# EAGLE design lcd (EAGLE 6.1)
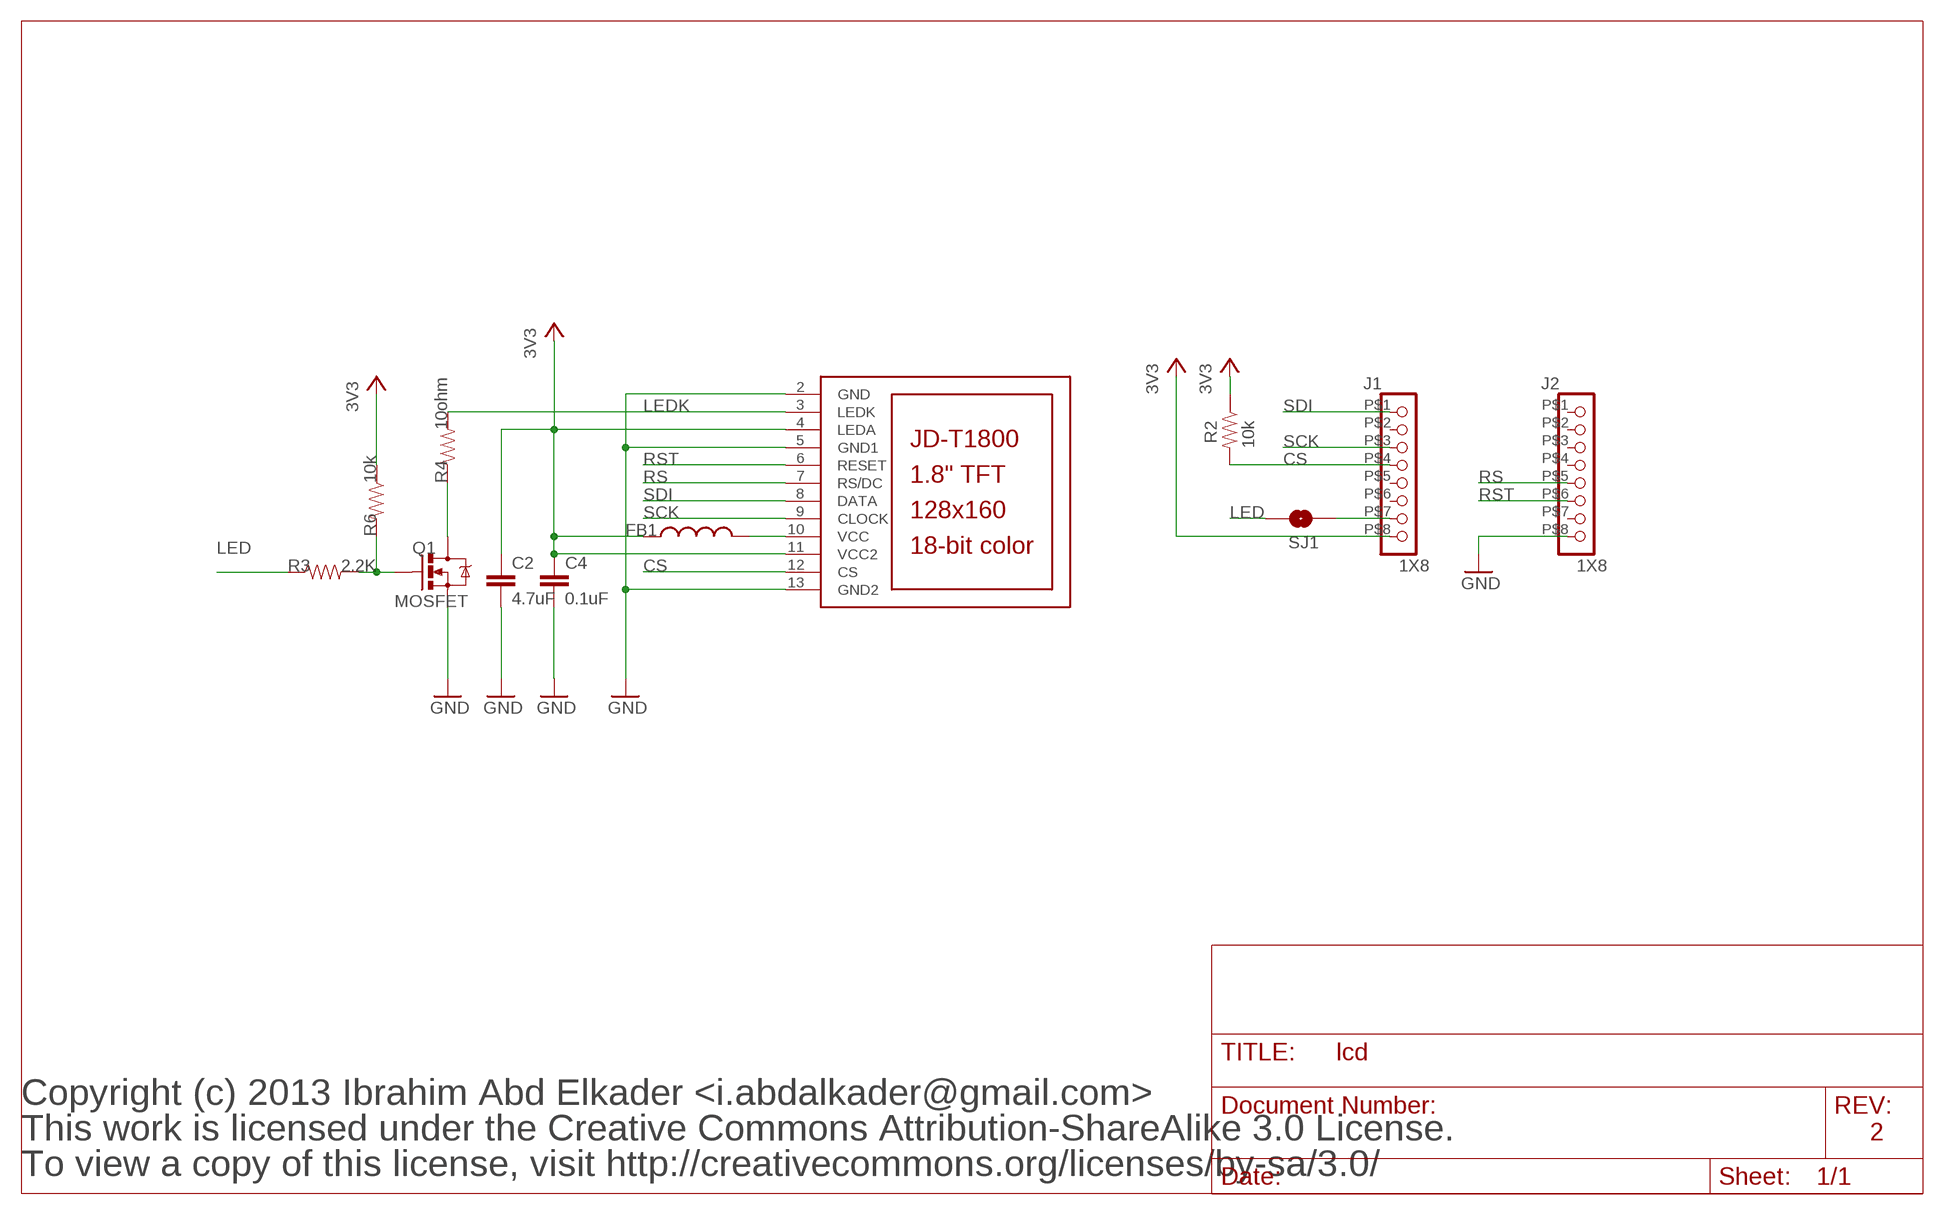
[diagram p0: schematic, sheet 1]

## Parts
C2  4.7uF  CAP0603-CAP  [0603-CAP]
C4  0.1uF  CAP0603-CAP  [0603-CAP]
FB1  INDUCTOR0603  [0603]
J1  1X8  [1X8]
J2  1X8  [1X8]
LCD1  JD-T1800  [JD-T1800]
Q1  MOSFET  MOSFET-NCHANNELSMD  [SOT23-3]
R2  10k  RESISTOR0603-RES  [0603-RES]
R3  2.2K  RESISTOR0603-RES  [0603-RES]
R4  10ohm  RESISTOR0603-RES  [0603-RES]
R6  10k  RESISTOR0603-RES  [0603-RES]
SJ1  SOLDERJUMPERTRACE  [SJ_2S-TRACE]

## Nets
3V3: C2.1 C4.1 FB1.1 J1.P$8 LCD1.4(LEDA) LCD1.11(VCC2) R2.1 R6.1
CS: J1.P$4 LCD1.12(CS) R2.2
GND: C2.2 C4.2 J2.P$8 LCD1.2(GND) LCD1.5(GND1) LCD1.13(GND2) Q1.2(S)
LED: R3.1 SJ1.2
LEDK: LCD1.3(LEDK) R4.2
N$2: J1.P$7 SJ1.1
N$5: Q1.1(G) R3.2 R6.2
N$14: Q1.3(D) R4.1
RS: J2.P$5 LCD1.7(RS/DC)
RST: J2.P$6 LCD1.6(RESET)
SCK: J1.P$3 LCD1.9(CLOCK)
SDI: J1.P$1 LCD1.8(DATA)
VDDA: FB1.2 LCD1.10(VCC)
Unconnected: J1.P$2 J1.P$5 J1.P$6 J2.P$1 J2.P$2 J2.P$3 J2.P$4 J2.P$7

## Notes on the sheet
- Copyright (c) 2013 Ibrahim Abd Elkader <i.abdalkader@gmail.com>
- This work is licensed under the Creative Commons Attribution-ShareAlike 3.0 License. | 2
- To view a copy of this license, visit http://creativecommons.org/licenses/by-sa/3.0/

## Library data of the parts
C2 C4 = sfe:CAP: Capacitor Standard 0603 ceramic capacitor, and 0.1" leaded capacitor.
FB1 = sfe:INDUCTOR: Inductors Basic Inductor/Choke - 0603 and 1206. Footprints are not proven and vary greatly between part numbers.
J1 J2 = sullins:1X8
LCD1 = adafruit:JD-T1800
Q1 = sfe:MOSFET-NCHANNEL
R2-R4 R6 = sfe:RESISTOR: Resistor Basic schematic elements and footprints for 0603, 1206, and PTH resistors.
SJ1 = sfe:SOLDERJUMPER: Solder Jumper Standard SMD solder jumper. Used to automate production. Two varients : Normally Open and Normally Closed are the same, but have different paste layers. NC will have a large amount of paste and should jumper during reflow.

## Net classes
1 vcc: width 1.016 mm, clearance 0.203 mm
2 antenna: width 0.363 mm, clearance 0.305 mm
3 1.8v: width 0.457 mm, clearance 0.254 mm

## Board
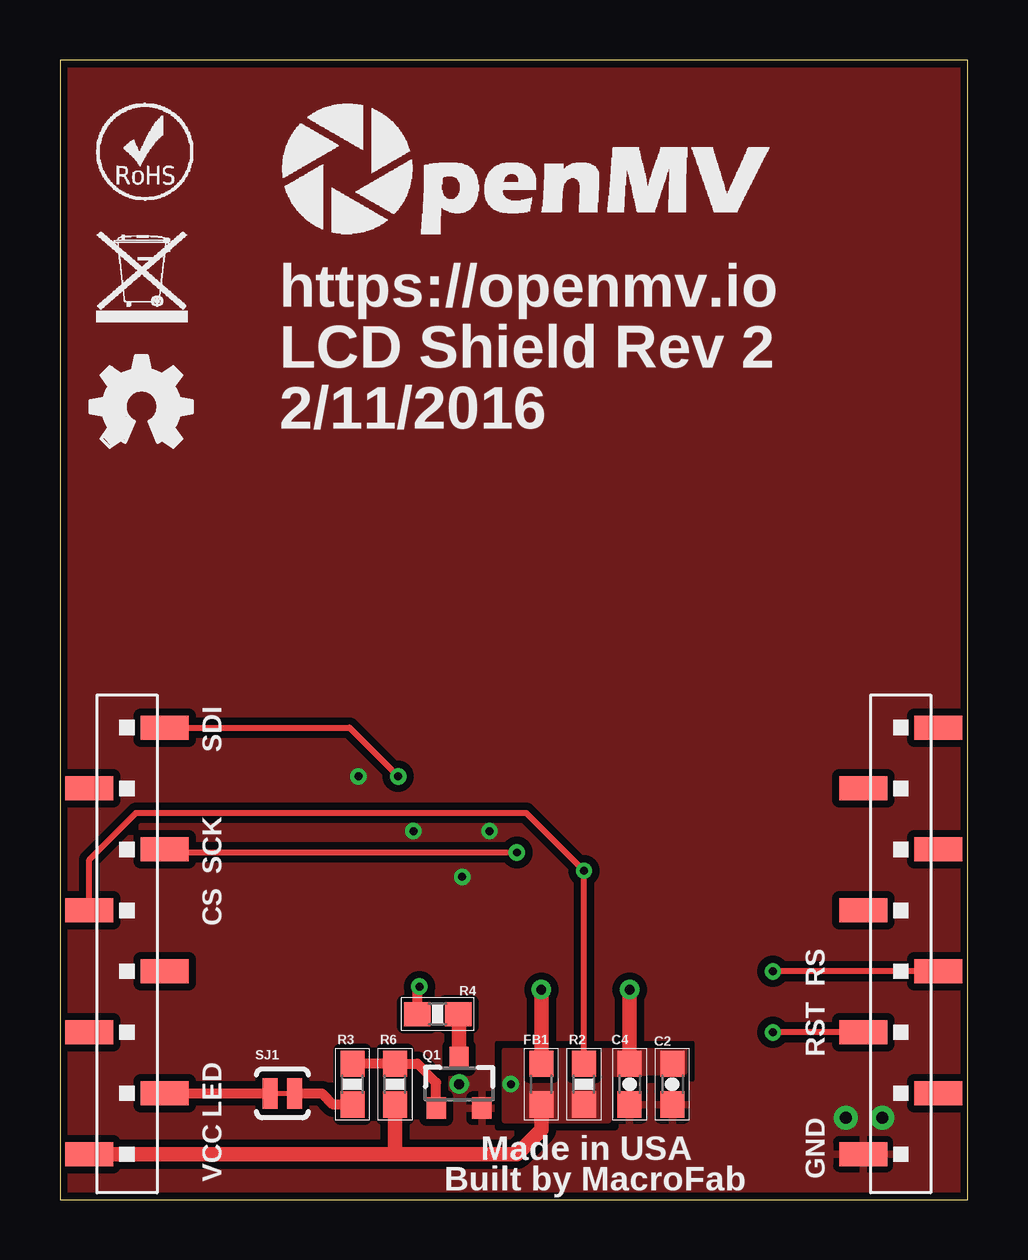
[diagram p1: board, top side]
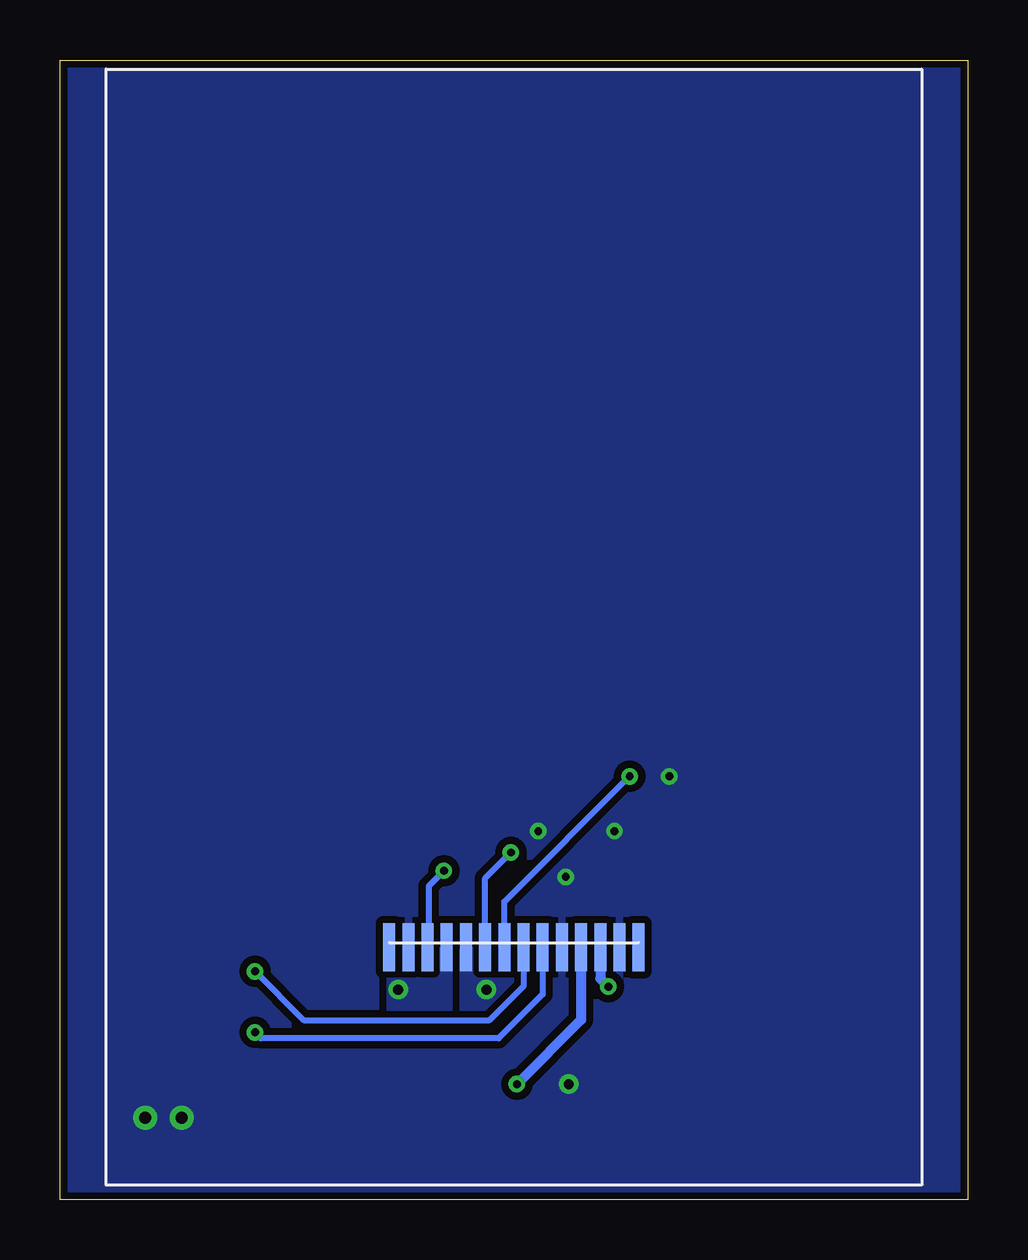
[diagram p2: board, bottom side, seen from below]

Size 37.85 x 47.5 mm. Coordinates in mm from the lower left corner, seen from the top.
Outline: 0,0 37.85,0 37.85,47.5 0,47.5 0,0
Copper layers (1*16): Top 0.0356mm / dielectric 1.5011mm / Bottom 0.0356mm
Design rules: minimum track width 6mil, minimum drill 13mil, track to track 6mil, track to pad 6mil, pad to pad 6mil, via to via 6mil, smd to smd 6mil, copper to edge 5mil, drill to drill 6mil, minimum pad ring 7mil, minimum via ring 7mil, stop-mask expansion 3mil, vias tented up to drill 30mil, thermal gap 10mil

### Footprints (pad centres in the part's own frame; a part is rotated, then mirrored left to right if it is on the bottom)
0603-CAP = smd 1.1 x 1: 1 -0.85,0; 2 0.85,0
0603 = smd 1.1 x 1: 1 -0.85,0; 2 0.85,0
1X8 = smd 1 x 2: P$1 8.89,-1.57; P$2 6.35,1.57; P$3 3.81,-1.57; P$4 1.27,1.57; P$5 -1.27,-1.57; P$6 -3.81,1.57; P$7 -6.35,-1.57; P$8 -8.89,1.57
JD-T1800 = smd 0.5 x 2: 1 5.2,-13.1; 2 4.4,-13.1; 3 3.6,-13.1; 4 2.8,-13.1; 5 2,-13.1; 6 1.2,-13.1; 7 0.4,-13.1; 8 -0.4,-13.1; 9 -1.2,-13.1; 10 -2,-13.1; 11 -2.8,-13.1; 12 -3.6,-13.1; 13 -4.4,-13.1; 14 -5.2,-13.1
SOT23-3 = smd 0.8 x 0.9: 1 -0.95,-1; 2 0.95,-1; 3 0,1.1
0603-RES = smd 1.1 x 1: 1 -0.85,0; 2 0.85,0
SJ_2S-TRACE = smd 0.635 x 1.27: 1 -0.508,0; 2 0.508,0

### Placement (x,y rotation side)
C2  25.53,4.83 270 top
C4  23.75,4.83 270 top
FB1  20.07,4.83 90 top
J1  2.79,10.79 90 top
J2  35.05,10.79 90 top
LCD1  18.92,23.62 0 bottom
Q1  16.64,4.83 0 top
R2  21.84,4.83 90 top
R3  12.19,4.83 90 top
R4  15.75,7.75 180 top
R6  13.97,4.83 90 top
SJ1  9.27,4.45 0 top
U$2  [ROHS]  1.52,41.66 0 top
U$3  [WEEE]  1.52,36.58 0 top
U$4  [OMV-LOGO-BIG]  9.27,40.26 0 top
U$5  [OSHW_FILLX150_NOTEXT]  1.27,31.37 0 top

### Tracks (layer width: path | path; a pad name or v marks a point on that pad's centre or on a via)
3V3  (via drill 0.33, 0.41)
  Top 0.61: J1.P$8 13.97,1.91 | 13.97,1.91 19.05,1.91 20.07,2.92 FB1.1 | C4.1 v23.75,8.76 | R6.1 13.97,1.91
  Bottom 0.406: LCD1.4 16.12,7.5 v18.8,4.83
  pour Top (isolate 0.254, no thermals): 18.54,6.22 26.04,6.22 26.04,5.33 22.86,5.21 22.86,3.3 18.54,3.3
  pour Bottom (isolate 0.254, no thermals): 21.59,10.41 24.13,10.41 24.13,7.87 21.59,7.87
CS  (via drill 0.33)
  Top 0.254: J1.P$4 1.22,14.18 3.17,16.13 19.43,16.13 v21.84,13.72 R2.2
  Bottom 0.254: v21.84,13.72 22.48,13.08 22.48,10.57 LCD1.12
GND  (via drill 0.33, 0.41, 0.5)
  other vias: 16.64,4.83 17.91,15.37 14.73,15.37 34.29,3.43 32.77,3.43 16.76,13.46 12.45,17.65
  pour Top (isolate 0.305, rank 2): 0.13,0.13 37.72,0.13 37.72,47.37 0.13,47.37
  pour Bottom (isolate 0.305, rank 2): 0.13,0.13 37.72,0.13 37.72,47.37 0.13,47.37
LED
  Top 0.406: SJ1.2 10.92,4.45 11.39,3.98 R3.1
LEDK  (via drill 0.33)
  Top 0.406: R4.2 14.9,8.8 v14.99,8.89
  Bottom 0.406: LCD1.3 15.32,9.23 v14.99,8.89
N$2
  Top 0.406: J1.P$7 SJ1.1
N$5
  Top 0.406: Q1.1 15.69,4.89 14.9,5.68 R6.2 R3.2
N$14
  Top 0.61: Q1.3 16.64,7.71 R4.1
RS  (via drill 0.33)
  Top 0.254: J2.P$5 v29.72,9.53
  Bottom 0.254: v29.72,9.53 27.69,7.49 19.94,7.49 18.52,8.91 LCD1.7
RST  (via drill 0.33)
  Top 0.254: 33.48,7.03 J2.P$6 v29.72,6.99
  Bottom 0.254: LCD1.6 17.72,8.57 19.56,6.73 29.46,6.73 v29.72,6.99
SCK  (via drill 0.33)
  Top 0.254: J1.P$3 4.45,14.61 4.57,14.48 v19.05,14.48
  Bottom 0.254: LCD1.9 20.12,13.4 v19.05,14.48
SDI  (via drill 0.33)
  Top 0.254: J1.P$1 12.06,19.68 v14.1,17.65
  Bottom 0.254: LCD1.8 19.32,12.43 v14.1,17.65
VDDA  (via drill 0.41)
  Top 0.61: FB1.2 v20.07,8.76
  pour Bottom (isolate 0.254, no thermals): 18.67,10.41 21.08,10.41 21.08,7.87 18.67,7.87

### Text on the board
tPlace: https://openmv.io | LCD Shield Rev 2 | 2/11/2016 | SDI | SCK | CS | RS | RST | LED | Made in USA | VCC | GND | Built by MacroFab